# Altium schematic sheet SheetTemplate.SchDoc
size A4; Organization: Altium Limited; Address1: L3, 12a Rodborough Rd; Address2: Frenchs Forest; Address3: NSW; Address4: Australia 2086; SheetNumber: 5; SheetTotal: 5
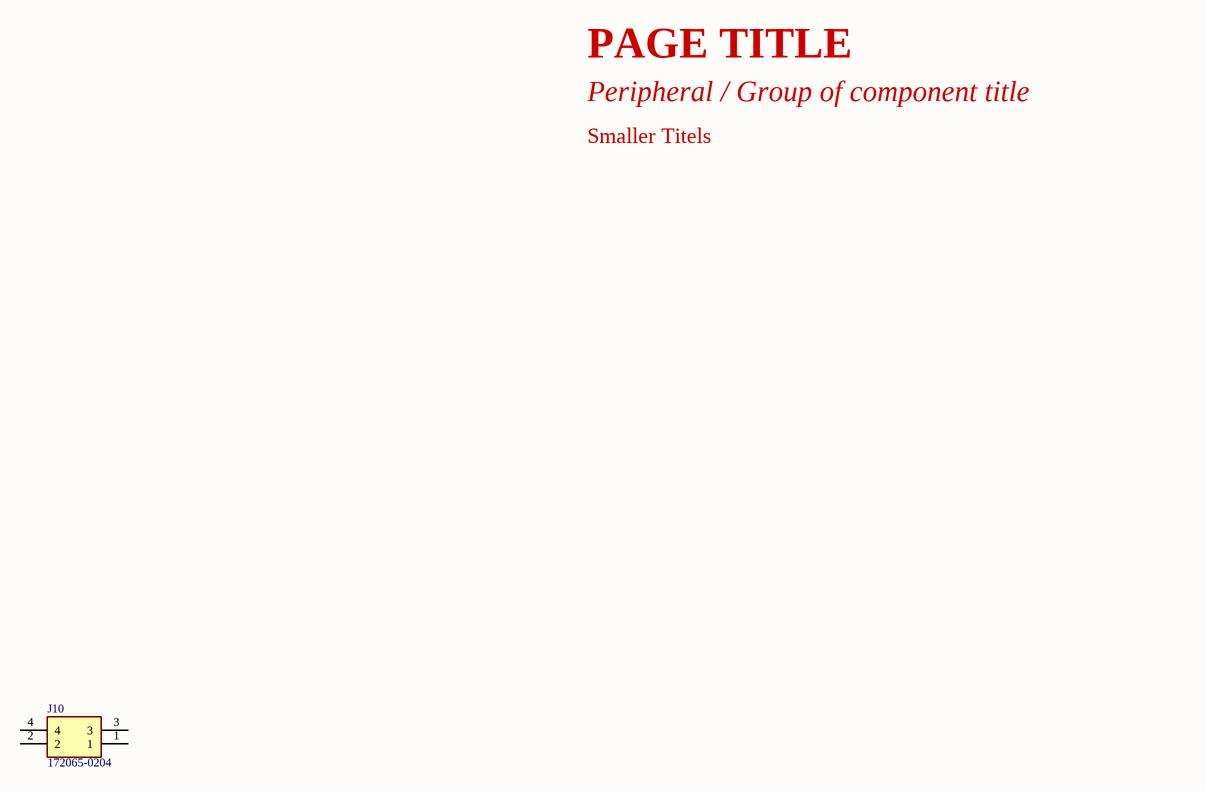
[diagram p0: SheetTemplate.SchDoc]

## Parts
J10  172065-0204  [1720650304]

## Nets

Not connected (* = marked no-connect by the designer): J10 1 2 3 4

## Notes on the sheet
- PAGE TITLE
- Peripheral / Group of component title
- Smaller Titels
- Title
- Size:
- Date:
- A4
- Number:
- Time:
- Revision:
- Sheet
- of
- File:

## Library data of the parts
J10 = 172065-0204: Connector; Manufacturer_Name: Molex; Datasheet Link: https://www.molex.com/pdm_docs/sd/1720650204_sd.pdf; Height: 14.8mm; Manufacturer_Part_Number: 172065-0204; Mouser Part Number: 538-172065-0204; Mouser Price/Stock: https://www.mouser.co.uk/ProductDetail/Molex/172065-0204?qs=BZBei1rCqCAr3g2d1EJiDQ%3D%3D; RS Part Number: 1615964P; RS Price/Stock: http://uk.rs-online.com/web/p/products/1615964P